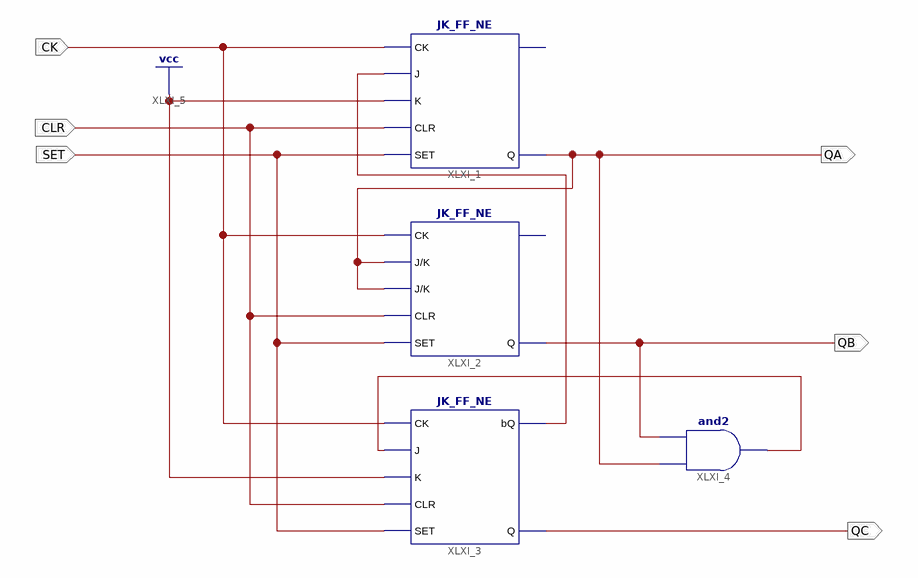
[diagram p0: schematic sheet 1]
// Xilinx ISE schematic Mod5.sch (spartan6) as structural Verilog: 4 symbols, 6 ports
module Mod5 (
  input  CK,
  input  CLR,
  input  SET,
  output QC,
  output QB,
  output QA
);

  wire XLXN_16, XLXN_20;

  JK_FF_NE XLXI_1 (.CK(CK), .J(XLXN_20), .K(1'b1), .CLR(CLR), .SET(SET), .Q(QA));  // open: bQ
  JK_FF_NE XLXI_2 (.CK(CK), .J(QA), .K(QA), .CLR(CLR), .SET(SET), .Q(QB));  // open: bQ
  JK_FF_NE XLXI_3 (.CK(CK), .J(XLXN_16), .K(1'b1), .CLR(CLR), .SET(SET), .bQ(XLXN_20), .Q(QC));
  and XLXI_4 (XLXN_16, QA, QB);
endmodule
